# Altium project ArduinoFanController.PrjPcb
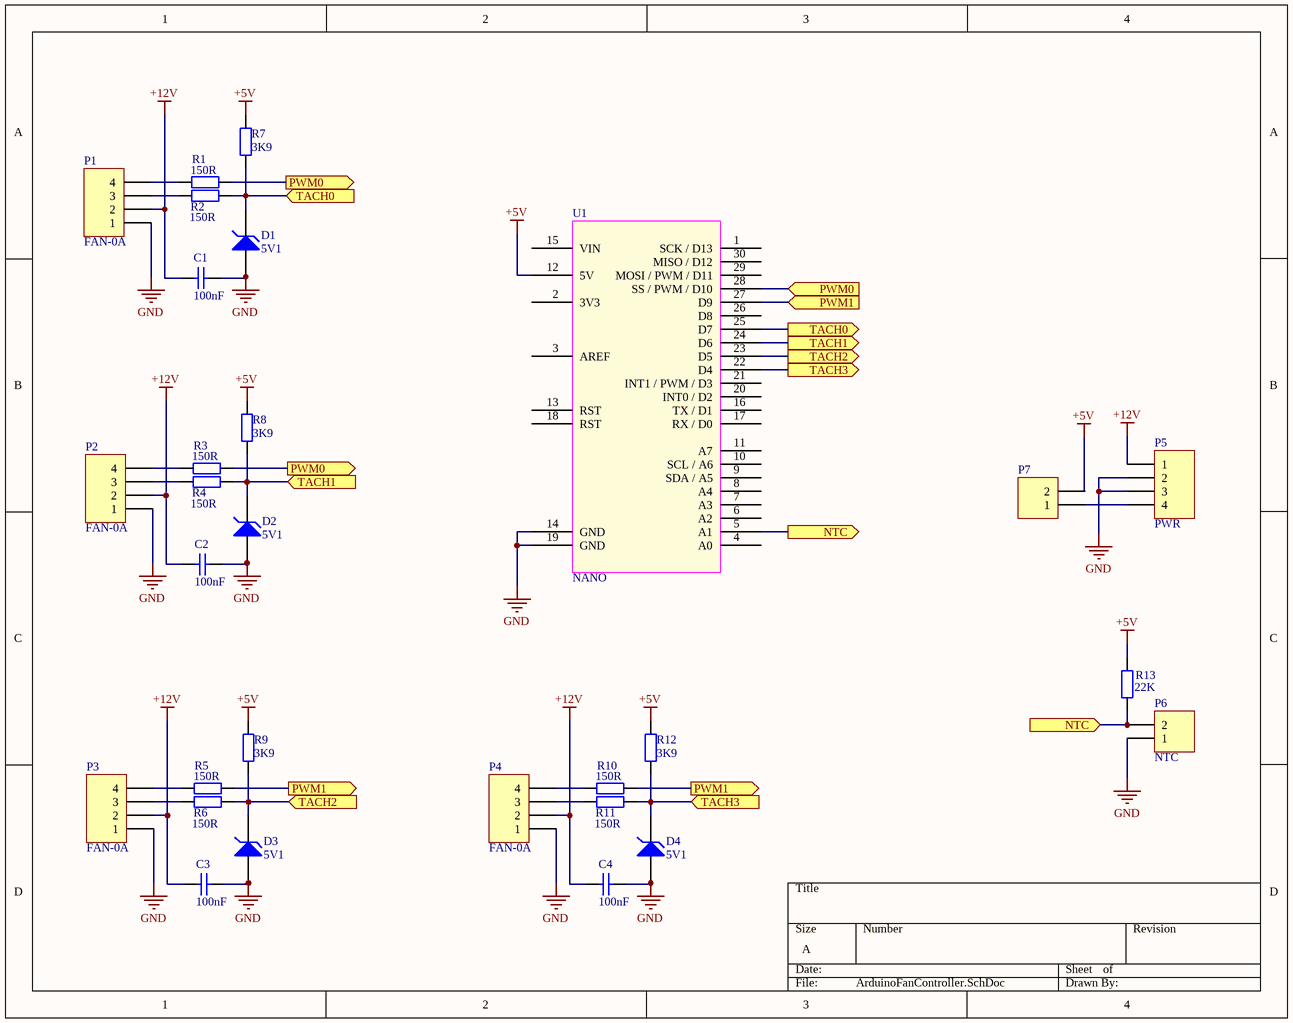
[diagram p0: ArduinoFanController.SchDoc]
1 sheet, 29 parts. Net scope: flat (ports and power ports of the same name join across sheets).
Board file: ArduinoFanController.PcbDoc

## Sheet ArduinoFanController.SchDoc
size A

### Parts
C1  value 100nF  [CAP200]  (hidden comment: Capacitor)
C2  value 100nF  [CAP200]  (hidden comment: Capacitor)
C3  value 100nF  [CAP200]  (hidden comment: Capacitor)
C4  value 100nF  [CAP200]  (hidden comment: Capacitor)
D1  5V1  [DIODE-0.4]
D2  5V1  [DIODE-0.4]
D3  5V1  [DIODE-0.4]
D4  5V1  [DIODE-0.4]
P1  FAN-0A  [HDR1X4]
P2  FAN-0A  [HDR1X4]
P3  FAN-0A  [HDR1X4]
P4  FAN-0A  [HDR1X4]
P5  PWR  [MOLEX4]
P6  NTC  [HDR1X2]
P7  Header 2  [HDR1X2]  (value not drawn)
R1  value 150R  [AXIAL-0.4]  (hidden comment: Res2)
R2  value 150R  [AXIAL-0.4]  (hidden comment: Res2)
R3  value 150R  [AXIAL-0.4]  (hidden comment: Res2)
R4  value 150R  [AXIAL-0.4]  (hidden comment: Res2)
R5  value 150R  [AXIAL-0.4]  (hidden comment: Res2)
R6  value 150R  [AXIAL-0.4]  (hidden comment: Res2)
R7  value 3K9  [AXIAL-0.4]  (hidden comment: Res2)
R8  value 3K9  [AXIAL-0.4]  (hidden comment: Res2)
R9  value 3K9  [AXIAL-0.4]  (hidden comment: Res2)
R10  value 150R  [AXIAL-0.4]  (hidden comment: Res2)
R11  value 150R  [AXIAL-0.4]  (hidden comment: Res2)
R12  value 3K9  [AXIAL-0.4]  (hidden comment: Res2)
R13  value 22K  [AXIAL-0.4]  (hidden comment: Res2)
U1  NANO  [DIP30]

### Ports
NTC (in), NTC (out), PWM0 (in), PWM0 (out), PWM1 (in), PWM1 (out), TACH0 (in), TACH0 (out), TACH1 (in), TACH1 (out), TACH2 (in), TACH2 (out), TACH3 (in), TACH3 (out)

### Nets
+5V: P7.2 R7.2 R8.2 R9.2 R12.2 R13.2 U1.12(5V)
+12V: C1.1 C2.1 C3.1 C4.1 P1.2 P2.2 P3.2 P4.2 P5.1
GND: C1.2 C2.2 C3.2 C4.2 D1.1(A) D2.1(A) D3.1(A) D4.1(A) P1.1 P2.1 P3.1 P4.1 P5.2 P5.3 P6.1 U1.14(GND) U1.19(GND)
NetD1_2: D1.2(K) R2.1 R7.1 U1.25(D7) ; port TACH0
NetD2_2: D2.2(K) R4.1 R8.1 U1.24(D6) ; port TACH1
NetD3_2: D3.2(K) R6.1 R9.1 U1.23(D5) ; port TACH2
NetD4_2: D4.2(K) R11.1 R12.1 U1.22(D4) ; port TACH3
NetP1_3: P1.3 R2.2
NetP1_4: P1.4 R1.2
NetP2_3: P2.3 R4.2
NetP2_4: P2.4 R3.2
NetP3_3: P3.3 R6.2
NetP3_4: P3.4 R5.2
NetP4_3: P4.3 R11.2
NetP4_4: P4.4 R10.2
NetP5_4: P5.4 P7.1
NetP6_2: P6.2 R13.1 U1.5(A1) ; port NTC
NetR1_1: R1.1 R3.1 U1.28(SS_/_PWM_/_D10) ; port PWM0
NetR5_1: R5.1 R10.1 U1.27(D9) ; port PWM1

Not connected (* = marked no-connect by the designer): U1 1(SCK_/_D13) 2(3V3) 3(AREF) 4(A0) 6(A2) 7(A3) 8(A4) 9(SDA_/_A5) 10(SCL_/_A6) 11(A7) 13(RST) 15(VIN) 16(TX_/_D1) 17(RX_/_D0) 18(RST) 20(INT0_/_D2) 21(INT1_/_PWM_/_D3) 26(D8) 29(MOSI_/_PWM_/_D11) 30(MISO_/_D12)

### Library data of the parts
C1-C4 = Cap np
D1-D4 = D Zener: Zener Diode; Published: 8-Jun-2000; LatestRevisionDate: 17-Jul-2002; LatestRevisionNote: Re-released for DXP Platform.; PackageReference: DIODE-0.7; Publisher: Altium Limited; PackageDescription: Diode, Thru-Hole; 2 Leads; 0.7 in Pin Spacing
P1-P4 = Header 4: Header, 4-Pin; LatestRevisionDate: 17-Jul-2002; LatestRevisionNote: Re-released for DXP Platform.; Publisher: Altium Limited
P5 = Molex 4: PC Molex connector, 4-Pin; LatestRevisionDate: 17-Jul-2002; LatestRevisionNote: Re-released for DXP Platform.; Publisher: Altium Limited
P6 P7 = Header 2: Header, 2-Pin; LatestRevisionDate: 17-Jul-2002; LatestRevisionNote: Re-released for DXP Platform.; Publisher: Altium Limited
R1-R13 = Res2: Resistor; Published: 8-Jun-2000; LatestRevisionDate: 17-Jul-2002; LatestRevisionNote: Re-released for DXP Platform.; PackageReference: AXIAL-0.4; Publisher: Altium Limited; PackageDescription: Axial Device, Thru-Hole; 2 Leads; 0.4 in Pin Spacing
U1 = Arduino Nano